# EAGLE design os20.oldenc (EAGLE 6.4)
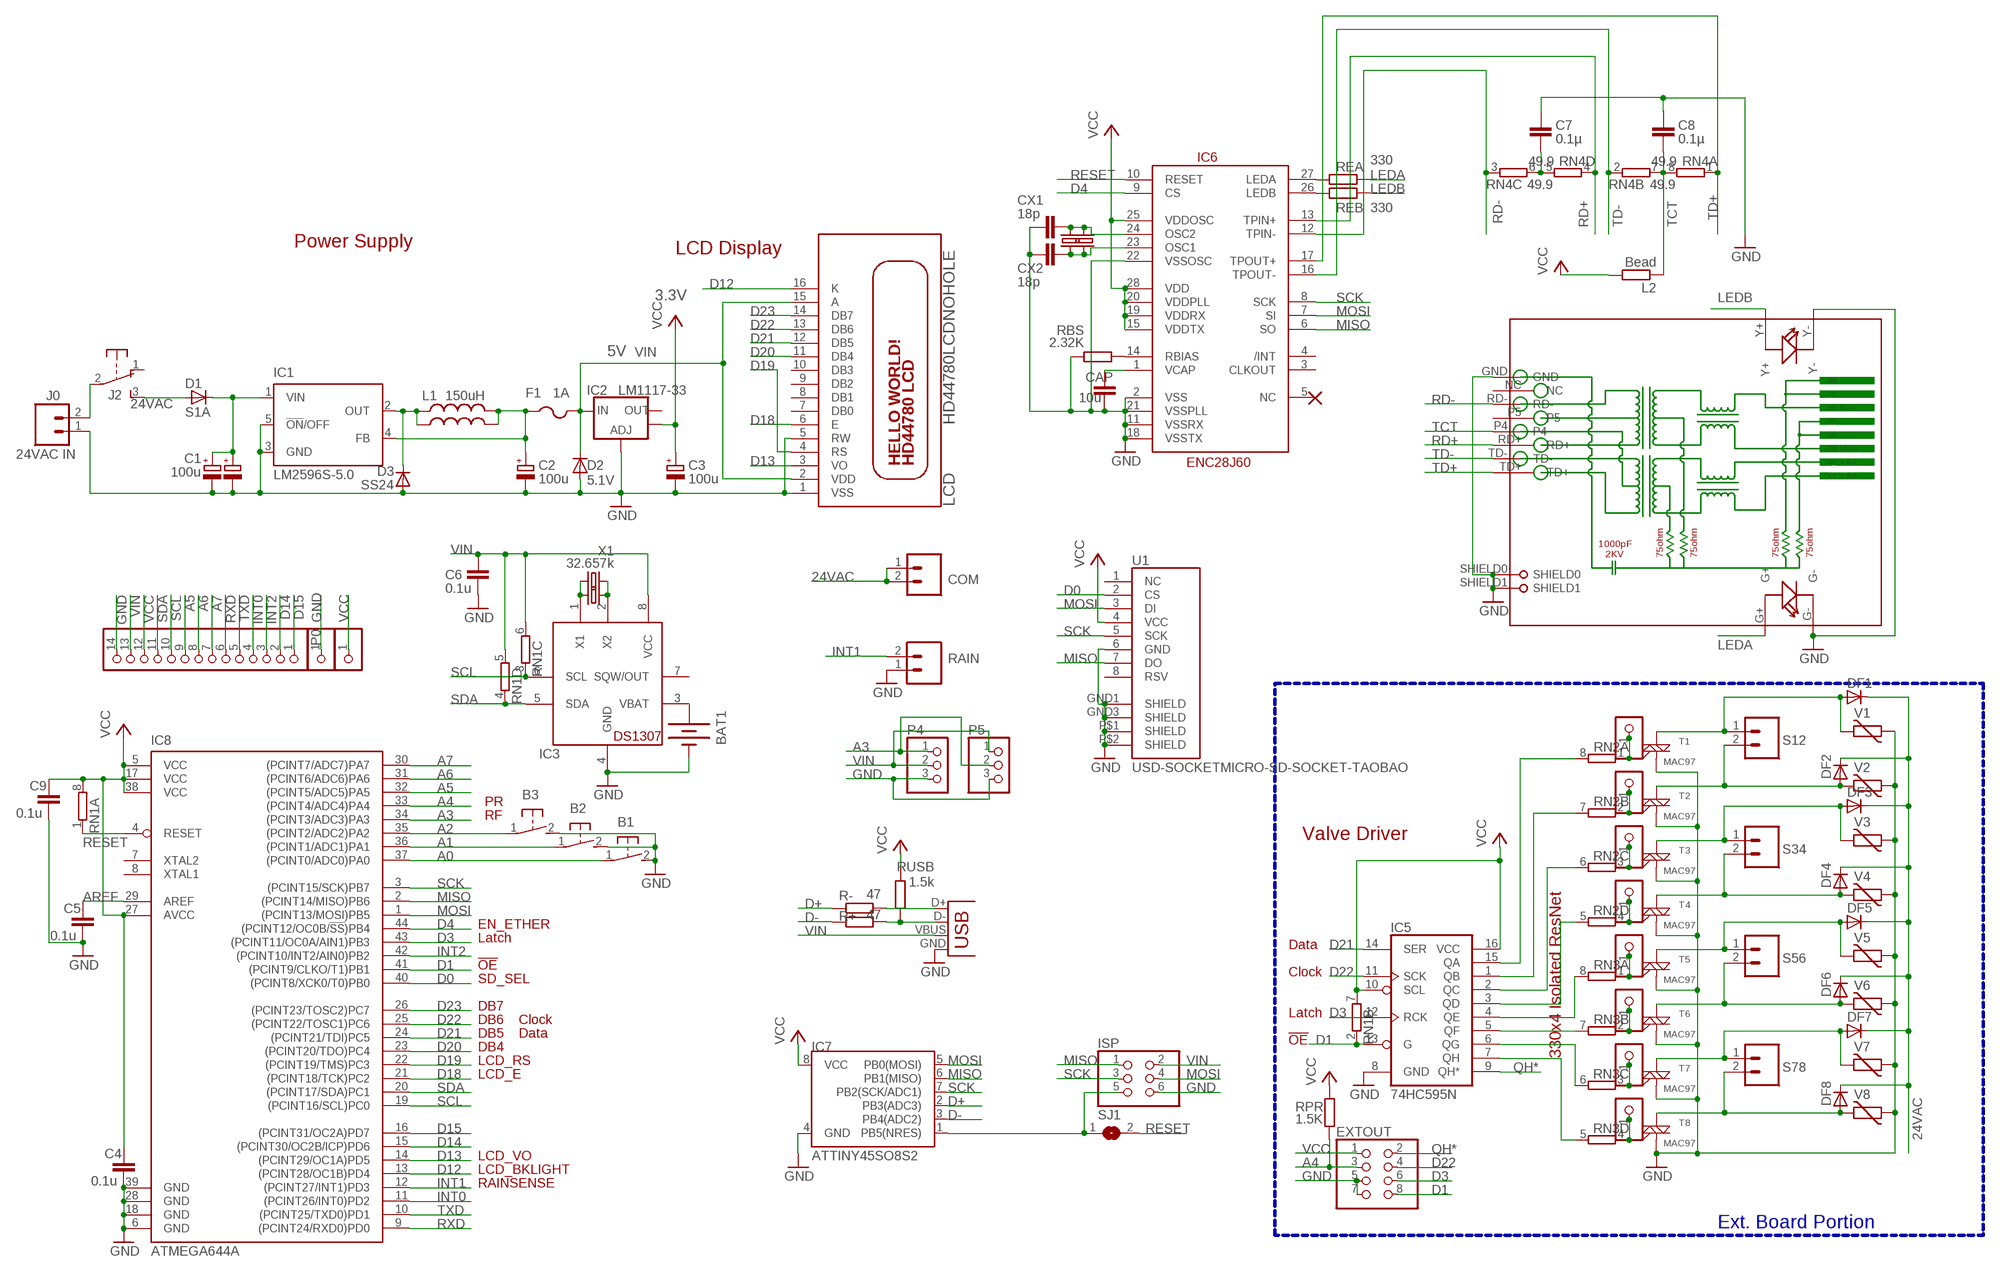
[diagram p0: schematic, sheet 1]

## Parts
B1  31-XX  [B3F-31XX]
B2  31-XX  [B3F-31XX]
B3  31-XX  [B3F-31XX]
BAT1  BATTERYBATTERY_12MM_SMT  [BATTCON_12MM_SMT]
C1  100u  CPOL-EUE3.5-8  [E3,5-8]
C1'  100u  CPOL-EUE  [PANASONIC_E]
C2  100u  CPOL-EUD  [PANASONIC_D]
C3  100u  CPOL-EUD  [PANASONIC_D]
C4  0.1u  C-EUC0805  [C0805]
C5  0.1u  C-EUC0805  [C0805]
C6  0.1u  C-EUC0805  [C0805]
C7  0.1µ  C-EUC0805  [C0805]
C8  0.1µ  C-EUC0805  [C0805]
C9  0.1u  C-EUC0805  [C0805]
CAP  10u  C-EUC0805  [C0805]
COM  M025MM  [SCREWTERMINAL-5MM-2]
CX1  18p  C-EUC0805  [C0805]
CX2  18p  C-EUC0805  [C0805]
D1  S1A  DIODE-DO-214AC  [DO-214AC]
D2  5.1V  DIODE-MINIMELF  [MINIMELF]
D3  SS24  DIODE-DO-214AC  [DO-214AC]
DF1  DIODE-D-2.5  [D-2.5]
DF2  DIODE-D-2.5  [D-2.5]
DF3  DIODE-D-2.5  [D-2.5]
DF4  DIODE-D-2.5  [D-2.5]
DF5  DIODE-D-2.5  [D-2.5]
DF6  DIODE-D-2.5  [D-2.5]
DF7  DIODE-D-2.5  [D-2.5]
DF8  DIODE-D-2.5  [D-2.5]
EXTOUT  PINHD-2X4  [2X04]
F1  1A  PTCFUSE-1812  [1812]
IC1  LM2596S-5.0  LM2596S  [TO263-5]
IC2  LM1117-33  V_REG_LM1117SOT223  [SOT223]
IC3  DS1307  DS1307SOIC  [SO08]
IC5  74HC595N  74LS595D  [SO16]
IC6  ENC28J60  ENC28J60SO28LONG  [SOIC28WLONG]
IC7  ATTINY45SO8S2  [SO8S2]
IC8  ATMEGA644A  [TQFP44]
ISP  PINHD-2X3  [2X03]
J0  24VAC IN  M025MM  [SCREWTERMINAL-5MM-2]
J2  EG1206  [EG1206]
JP2  PINHD-1X1CB  [1X01-CLEANBIG]
JP3  PINHD-1X1CB  [1X01-CLEANBIG]
JP4  PINHD-1X1CB  [1X01-CLEANBIG]
JP5  PINHD-1X1CB  [1X01-CLEANBIG]
JP6  PINHD-1X1CB  [1X01-CLEANBIG]
JP7  PINHD-1X1CB  [1X01-CLEANBIG]
JP8  PINHD-1X1CB  [1X01-CLEANBIG]
JP9  PINHD-1X1CB  [1X01-CLEANBIG]
L1  150uH  L-US6000-XXX-RC  [6000-XXXX-RC]
L1'  220uH  INDUCTORPWR  [CDRH125]
L2  Bead  R-EU_R0805  [R0805]
LCD  HD44780LCDNOHOLE  [LCD1602A]
P0  PINHD-1X14-CB  [1X14-CB]
P1  PINHD-1X1CB  [1X01-CLEANBIG]
P2  PINHD-1X1CB  [1X01-CLEANBIG]
P4  PINHD-1X3  [1X03]
P5  PINHD-1X3  [1X03]
R+  47  R-EU_R0805  [R0805]
R-  47  R-EU_R0805  [R0805]
RAIN  M025MM  [SCREWTERMINAL-5MM-2]
RBS  2.32K  R-EU_R0805  [R0805]
REA  330  R-EU_R0805  [R0805]
REB  330  R-EU_R0805  [R0805]
RJ1  HR911105A  [HR911105A]
RN1  4R-NEXB38V  [EXB38V]
RN2  4R-NEXB38V  [EXB38V]
RN3  4R-NEXB38V  [EXB38V]
RN4  49.9  4R-NEXB38V  [EXB38V]
RPR  1.5K  R-EU_R0805  [R0805]
RUSB  1.5k  R-EU_R0805  [R0805]
S12  M025MM  [SCREWTERMINAL-5MM-2]
S34  M025MM  [SCREWTERMINAL-5MM-2]
S56  M025MM  [SCREWTERMINAL-5MM-2]
S78  M025MM  [SCREWTERMINAL-5MM-2]
SJ1  SJ  [SJ]
T1  MAC97  MAC97SOT223  [SOT223]
T2  MAC97  MAC97SOT223  [SOT223]
T3  MAC97  MAC97SOT223  [SOT223]
T4  MAC97  MAC97SOT223  [SOT223]
T5  MAC97  MAC97SOT223  [SOT223]
T6  MAC97  MAC97SOT223  [SOT223]
T7  MAC97  MAC97SOT223  [SOT223]
T8  MAC97  MAC97SOT223  [SOT223]
U1  USD-SOCKETMICRO-SD-SOCKET-TAOBAO  [MICRO-SD-SOCKET-TAOBAO]
USB  USBPTH  [USB-B-PTH]
V1  MOV  VARISTOR-5  [R-5]
V2  MOV  VARISTOR-5  [R-5]
V3  MOV  VARISTOR-5  [R-5]
V4  MOV  VARISTOR-5  [R-5]
V5  MOV  VARISTOR-5  [R-5]
V6  MOV  VARISTOR-5  [R-5]
V7  MOV  VARISTOR-5  [R-5]
V8  MOV  VARISTOR-5  [R-5]
X1  32.657k  CRYSTALTC26H  [TC26H]
X1'1  32.657k  CRYSTALMM20SS  [MM20SS]
X2  25MHz  CRYSTAL10.5X4.8  [CRYSTAL-SMD-10.5X4.8-2PIN]
X2'  25MHz  CRYSTALHC49US  [HC49US]

## Nets
24VAC [power]: COM.1 COM.2 D1.A DF1.C DF2.C DF3.C DF4.C DF5.C DF6.C DF7.C DF8.C J2.3(S)
A0: B1.1(P) IC8.37((PCINT0/ADC0)PA0)
A1: B2.1(P) IC8.36((PCINT1/ADC1)PA1)
A2: B3.1(P) IC8.35((PCINT2/ADC2)PA2)
A3: IC8.34((PCINT3/ADC3)PA3) P4.1 P5.2
A4: EXTOUT.3 IC8.33((PCINT4/ADC4)PA4) RPR.1
A5: IC8.32((PCINT5/ADC5)PA5) P0.9
A6: IC8.31((PCINT6/ADC6)PA6) P0.8
A7: IC8.30((PCINT7/ADC7)PA7) P0.7
AREF: C5.1 IC8.29(AREF)
D0: IC8.40((PCINT8/XCK0/T0)PB0) U1.2(CS)
D1: EXTOUT.8 IC5.13(G) IC8.41((PCINT9/CLKO/T1)PB1) RN1.2
D3: EXTOUT.6 IC5.12(RCK) IC8.43((PCINT11/OC0A/AIN1)PB3)
D4: IC6.9(CS) IC8.44((PCINT12/OC0B/!SS!)PB4)
D12: IC8.13((PCINT28/OC1B)PD4) LCD.16(K)
D13: IC8.14((PCINT29/OC1A)PD5) LCD.3(VO)
D14: IC8.15((PCINT30/OC2B/ICP)PD6) P0.2
D15: IC8.16((PCINT31/OC2A)PD7) P0.1
D18: IC8.21((PCINT18/TCK)PC2) LCD.6(E)
D19: IC8.22((PCINT19/TMS)PC3) LCD.4(RS)
D20: IC8.23((PCINT20/TDO)PC4) LCD.11(DB4)
D21: IC5.14(SER) IC8.24((PCINT21/TDI)PC5) LCD.12(DB5)
D22: EXTOUT.4 IC5.11(SCK) IC8.25((PCINT22/TOSC1)PC6) LCD.13(DB6)
D23: IC8.26((PCINT23/TOSC2)PC7) LCD.14(DB7)
D+: IC7.2(PB3(ADC3)) R-.1
D-: IC7.3(PB4(ADC2)) R+.1
GND: B1.2(S) B2.2(S) B3.2(S) BAT1.P$1(-) C1'.- C1.- C2.- C3.- C4.2 C5.2 C6.2 C7.1 C8.1 C9.2 CAP.2 CX1.2 CX2.2 D2.A D3.A EXTOUT.5 EXTOUT.7 IC1.3(GND) IC1.5(!ON!/OFF) IC2.1(ADJ) IC3.4(GND) IC5.8(GND) IC6.2(VSS) IC6.11(VSSRX) IC6.18(VSSTX) IC6.21(VSSPLL) IC6.22(VSSOSC) IC7.4(GND) IC8.6(GND) IC8.18(GND) IC8.28(GND) IC8.39(GND) ISP.6 J0.1 LCD.1(VSS) LCD.5(RW) P0.14 P2.1 P4.3 P5.3 RAIN.1 RBS.1 RJ1.G- RJ1.GND RJ1.SHIELD0 RJ1.SHIELD1 RJ1.Y- T1.1(M1) T2.1(M1) T3.1(M1) T4.1(M1) T5.1(M1) T6.1(M1) T7.1(M1) T8.1(M1) U1.6(GND) U1.GND1(SHIELD) U1.GND3(SHIELD) U1.P$1(SHIELD) U1.P$2(SHIELD) USB.GND V1.1 V2.1 V3.1 V4.1 V5.1 V6.1 V7.1 V8.1
INT0: IC8.11((PCINT26/INT0)PD2) P0.4
INT1: IC8.12((PCINT27/INT1)PD3) RAIN.2
INT2: IC8.42((PCINT10/INT2/AIN0)PB2) P0.3
LEDA: REA.2 RJ1.G+
LEDB: REB.2 RJ1.Y+
MISO: IC6.6(SO) IC7.6(PB1(MISO)) IC8.2((PCINT14/MISO)PB6) ISP.1 U1.7(DO)
MOSI: IC6.7(SI) IC7.5(PB0(MOSI)) IC8.1((PCINT13/MOSI)PB5) ISP.4 U1.3(DI)
N$1 [power]: C1'.+ C1.+ D1.C IC1.1(VIN)
N$2 [power]: C2.+ F1.1 IC1.4(FB) L1'.2 L1.2
N$3: JP2.1 RN2.1 T1.3(G)
N$4: IC5.5(QF) RN3.7
N$5: IC5.6(QG) RN3.6
N$6 [power]: J0.2 J2.2(P)
N$7: IC5.7(QH) RN3.5
N$8: IC3.1(X1) X1'1.1 X1.2
N$9 [power]: D3.C IC1.2(OUT) L1'.1 L1.1
N$10: IC5.4(QE) RN3.8
N$11: IC5.3(QD) RN2.5
N$12: IC5.2(QC) RN2.6
N$13: IC5.1(QB) RN2.7
N$14: IC5.15(QA) RN2.8
N$15: JP3.1 RN2.2 T2.3(G)
N$16 [power]: DF1.A S12.1 T1.4(M2) V1.2
N$17 [power]: DF2.A S12.2 T2.4(M2) V2.2
N$18 [power]: DF3.A S34.1 T3.4(M2) V3.2
N$19: JP4.1 RN2.3 T3.3(G)
N$20 [power]: DF4.A S34.2 T4.4(M2) V4.2
N$21: JP5.1 RN2.4 T4.3(G)
N$22 [power]: DF5.A S56.1 T5.4(M2) V5.2
N$23 [power]: DF6.A S56.2 T6.4(M2) V6.2
N$24 [power]: DF7.A S78.1 T7.4(M2) V7.2
N$25 [power]: DF8.A S78.2 T8.4(M2) V8.2
N$26: JP6.1 RN3.1 T5.3(G)
N$27: JP7.1 RN3.2 T6.3(G)
N$28: JP8.1 RN3.3 T7.3(G)
N$29: JP9.1 RN3.4 T8.3(G)
N$30: IC3.2(X2) X1'1.4 X1.1
N$34: IC6.27(LEDA) REA.1
N$36: BAT1.P$2(+) IC3.3(VBAT)
N$37: IC6.26(LEDB) REB.1
N$38: R-.2 USB.D+
N$39: CAP.1 IC6.1(VCAP)
N$41: CX1.1 IC6.24(OSC2) X2'.2 X2.P$2
N$42: CX2.1 IC6.23(OSC1) X2'.1 X2.P$1
N$45: R+.2 RUSB.1 USB.D-
N$52: IC7.1(PB5(NRES)) ISP.5 SJ1.1
N$54: C7.2 RN4.5 RN4.6
N$59: IC6.14(RBIAS) RBS.2
QH*: EXTOUT.2 IC5.9(QH*)
RD+: IC6.13(TPIN+) RJ1.RD+ RN4.4
RD-: IC6.12(TPIN-) RJ1.RD- RN4.3
RESET: IC6.10(RESET) IC8.4(RESET) RN1.1 SJ1.2
RXD: IC8.9((PCINT24/RXD0)PD0) P0.6
SCK: IC6.8(SCK) IC7.7(PB2(SCK/ADC1)) IC8.3((PCINT15/SCK)PB7) ISP.3 U1.5(SCK)
SCL: IC3.6(SCL) IC8.19((PCINT16/SCL)PC0) P0.10 RN1.3
SDA: IC3.5(SDA) IC8.20((PCINT17/SDA)PC1) P0.11 RN1.4
TCT: C8.2 L2.1 RJ1.P4 RN4.7 RN4.8
TD+: IC6.17(TPOUT+) RJ1.TD+ RN4.1
TD-: IC6.16(TPOUT-) RJ1.TD- RN4.2
TXD: IC8.10((PCINT25/TXD0)PD1) P0.5
VCC: C3.+ C4.1 C9.1 EXTOUT.1 IC2.4(OUT) IC5.10(SCL) IC5.16(VCC) IC6.15(VDDTX) IC6.19(VDDRX) IC6.20(VDDPLL) IC6.25(VDDOSC) IC6.28(VDD) IC7.8(VCC) IC8.5(VCC) IC8.17(VCC) IC8.27(AVCC) IC8.38(VCC) L2.2 P0.12 P1.1 RN1.7 RN1.8 RPR.2 RUSB.2 U1.4(VCC)
VIN [power]: C6.1 D2.C F1.2 IC2.3(IN) IC3.8(VCC) ISP.2 LCD.2(VDD) LCD.15(A) P0.13 P4.2 P5.1 RN1.5 RN1.6 USB.VBUS
Unconnected: IC2.2(OUT) IC3.7(SQW/OUT) IC6.3(CLKOUT) IC6.4(/INT) IC6.5(NC) IC8.7(XTAL2) IC8.8(XTAL1) J2.1(O) LCD.7(DB0) LCD.8(DB1) LCD.9(DB2) LCD.10(DB3) RJ1.NC RJ1.P5 U1.1(NC) U1.8(RSV)

## Buses
B$1

## Notes on the sheet
- Power Supply
- LCD Display
- 3.3V
- 5V
- PR
- RF
- Valve Driver
- EN_ETHER
- Latch
- Data
- !OE
- Clock
- SD_SEL
- DB7
- Latch
- DB6 | Clock
- DB5 | Data
- !OE
- DB4
- 330x4 Isolated ResNet
- LCD_RS
- LCD_E
- LCD_VO
- LCD_BKLIGHT
- RAINSENSE
- Ext. Board Portion

## Library data of the parts
B1-B3 = adafruit:31-XX: OMRON SWITCH Now with beefier pads!
BAT1 = SparkFunNew:BATTERY: Battery Holders Various common sizes : AA, AAA, 20mm coin cell and 12mm coin cell.
C1 C1' C2 C3 = resistor:CPOL-EU: POLARIZED CAPACITOR, European symbol
C4-C6 C9 = rcl:C-EU: CAPACITOR, European symbol
C7 C8 CAP CX1 CX2 = resistor:C-EU: CAPACITOR, European symbol
COM J0 RAIN S12 S34 S56 S78 = SparkFun:M02: Header 2 Standard 2-pin 0.1" header. Use with straight break away headers (SKU : PRT-00116), right angle break away headers (PRT-00553), swiss pins (PRT-00743), machine pins (PRT-00117), and female headers (PRT-00115). Molex polarized connector foot print use with SKU : PRT-08233 with associated crimp pins and housings.
D1-D3 DF1-DF8 = diode:DIODE-: DIODE
EXTOUT = pinhead:PINHD-2X4: PIN HEADER
F1 = adafruit:PTCFUSE: PTC fuses, resettable thermistors
IC1 = national-semiconductor:LM2596: SIMPLE SWITCHER® Power Converter 150 kHz 3A Step-Down Voltage Regulator Source: http://www.national.com/ds/LM/LM2596.pdf; MF: NATIONAL SEMICONDUCTOR; MPN: LM2596S-ADJ/NOPB; OC_FARNELL: 9494367; OC_NEWARK: 41K3842
IC2 = SparkFun:V_REG_LM1117: Voltage Regulator LM1117 Standard adjustable voltage regulator but in SMD form. Spark Fun Electronics SKU : COM-00595
IC3 = adafruit:DS1307: DS1307 Real time clock (RTC) with battery backup ability. Talk to it via i2c
IC5 = SparkFun:74*595: 8-bit SHIFT REGISTER, output latch
IC6 = SparkFun:ENC28J60
IC7 = SparkFun:ATTINY45: Atmel ATTiny45
IC8 = atmel:ATMEGA644: 8-bit Microcontroller with 64K Bytes In-System Programmable Flash Source: http://www.atmel.com/dyn/resources/prod_documents/doc2593.pdf; MPN: ATMEGA644PV-10AU; OC_FARNELL: 1455123; OC_NEWARK: 58M3748
ISP = pinhead:PINHD-2X3: PIN HEADER
J2 = adafruit:EG1206
JP2-JP9 P1 P2 = adafruit:PINHD-1X1: Pin header 1x1 for 0.1" spacing With round pins
L1 = rcl:L-US: INDUCTOR, American symbol
L1' = SparkFunNew:INDUCTOR: Inductors Basic Inductor/Choke - 0603 and 1206. Footprints are not proven and vary greatly between part numbers.
L2 R+ R- RBS REA REB RPR RUSB = rcl:R-EU_: RESISTOR, European symbol
LCD = adafruit:HD44780LCD: HD44780 LCD Standard character type LCDs, available in sizes from 8x1 to 40x4!
P0 = adafruit:PINHD-1X14: PIN HEADER
P4 P5 = pinhead:PINHD-1X3: PIN HEADER
RJ1 = CONNECTER:HR911105A
RN1-RN4 = resistor-dil:4R-N: Array Chip Resistor Source: RS Component / Phycomp; OC_FARNELL: unknown; OC_NEWARK: unknown
SJ1 = jumper:SJ: SMD solder JUMPER
T1-T8 = SparkFun:MAC97: MAC97 Triac http://www.onsemi.com/pub_link/Collateral/MAC97-D.PDF
U1 = SparkFunNew:USD-SOCKET: microSD Socket Push-push type uSD socket. Schematic element and footprint production proven. Spark Fun Electronics SKU : PRT-00127. tDoc lines correctly indicate media card edge positions when inserting (unlocked, locked, depressed).
USB = SparkFunNew:USB: USB Connectors USB-B-PTH is fully proven SKU : PRT-00139 USB-miniB is fully proven SKU : PRT-00587 USB-A-PCB is untested. USB-A-H is throughly reviewed, but untested. Spark Fun Electronics SKU : PRT-00437 USB-B-SMT is throughly reviewed, but untested. Needs silkscreen touching up. USB-A-S has not been used/tested USB-MB-H has not been used/tested
V1-V8 = varistor:VARISTOR: VARISTOR
X1 X1'1 = crystal:CRYSTAL: CRYSTAL; OC_FARNELL: unknown; OC_NEWARK: unknown
X2 X2' = SparkFun:CRYSTAL: Crystals Various standard crystals. Proven footprints. Spark Fun Electronics SKU : COM-00534

## Net classes
0 default: width 0.305 mm, clearance 0.203 mm
1 power: width 0.61 mm, clearance 0.203 mm

## Board
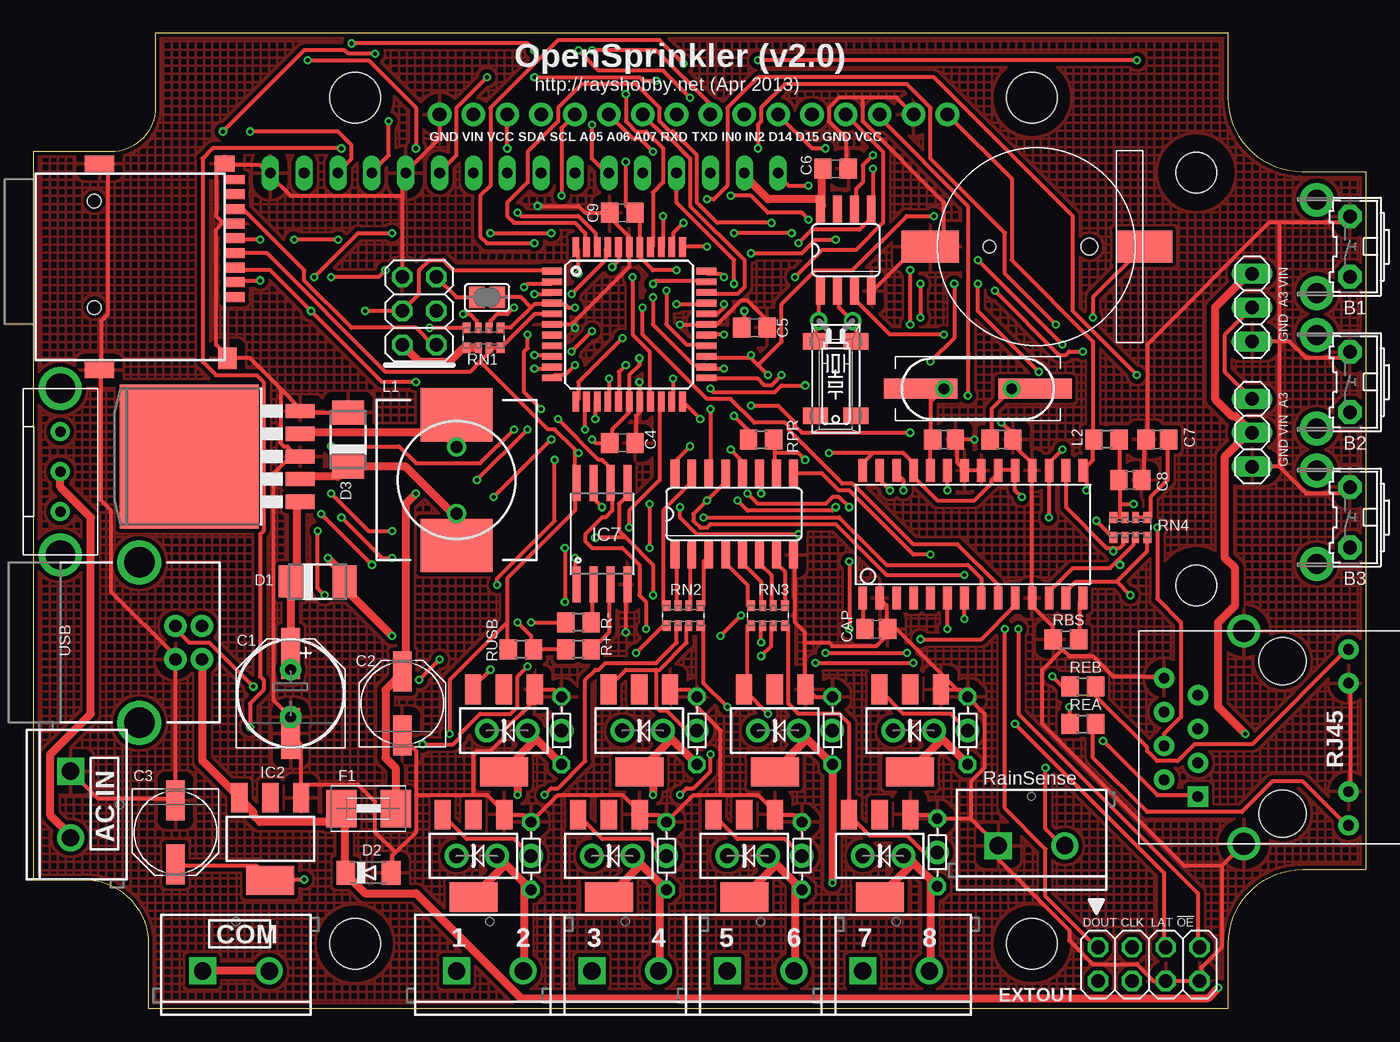
[diagram p1: board, top side]
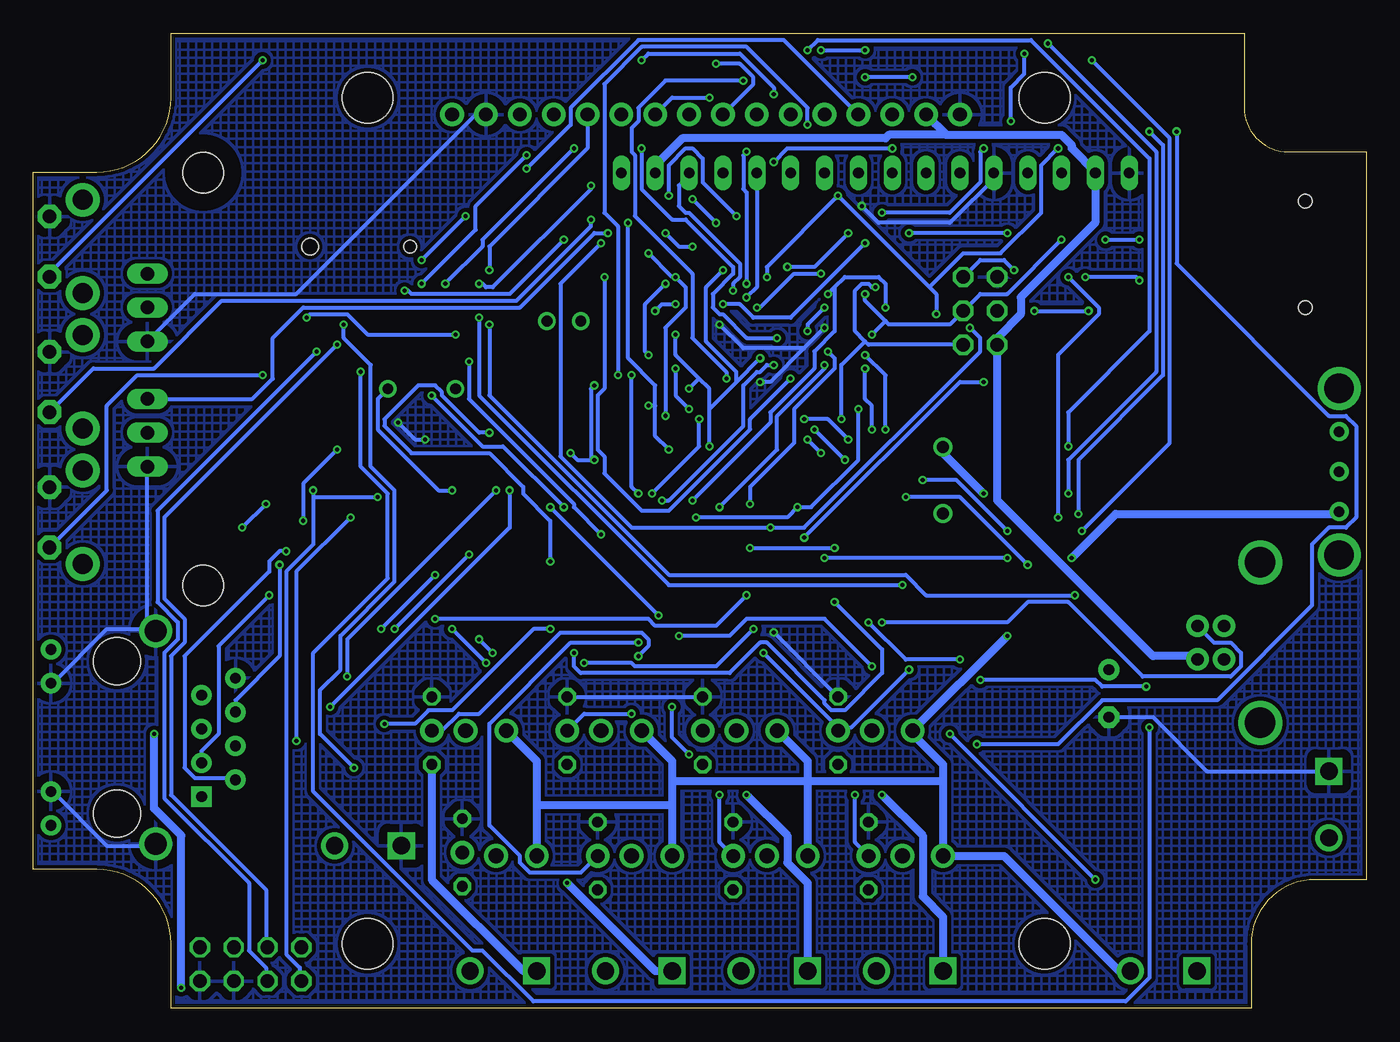
[diagram p2: board, bottom side, seen from below]

Size 100 x 73.15 mm. Coordinates in mm from the lower left corner, seen from the top.
Outline: 8.64,0 89.66,0 89.66,4.83 arc-90 95.25,10.41 100,10.41 100,62.74 95.25,62.74 arc-90 89.66,68.33 89.66,73.15 9.14,73.15 9.14,67.56 arc-90 5.84,64.26 0,64.26 0,9.65 3.81,9.65 arc-90 8.64,4.83 8.64,0
Copper layers (1*16): Top 0.035mm / dielectric 1.5mm / Bottom 0.035mm
Design rules "default": minimum track width 6mil, minimum drill 12mil, track to track 6mil, track to pad 6mil, pad to pad 8mil, via to via 8mil, smd to smd 0mil, copper to edge 10mil, drill to drill 10mil, minimum pad ring 10mil, minimum via ring 6mil, stop-mask expansion 2mil, vias tented up to drill 100mil, thermal gap 25mil
Holes 3.81 mm at 24.13,4.83 74.93,4.83 24.13,68.33 74.93,68.33
Holes 3.05 mm at 87.25,62.69 87.25,31.72
tRestrict: area 21.6,2.3 to 26.7,7.4; area 72.4,2.3 to 77.5,7.4; area 84.7,29.2 to 89.8,34.3; area 84.7,60.1 to 89.8,65.2; area 21.6,65.8 to 26.7,70.9; area 72.4,65.8 to 77.5,70.9
bRestrict: area 84.7,60.1 to 89.8,65.2; area 84.7,29.2 to 89.8,34.3
vRestrict: area 78.7,6.1 to 88.1,6.6; area 72.1,0.5 to 77.7,1.5; area 29.7,65 to 69.6,65.8

### Footprints (pad centres in the part's own frame; a part is rotated, then mirrored left to right if it is on the bottom)
B3F-31XX = drill 1.016 pad 1.778 octagon: 1 -2.261,-1.245; 2 2.261,-1.245 | drill 1.499 pad 2.54: 3 -3.505,1.245; 4 3.505,1.245
BATTCON_12MM_SMT = smd 2.4 x 4.3: P$1 0,11.96 | smd 2.4 x 4.2: P$2 0,-4.1 | hole 0.95: 0,7.5 | hole 1.25: 0,0
E3,5-8 = drill 0.813 pad 1.6: + -1.778,0 | drill 0.813 pad 1.6 octagon: - 1.778,0
PANASONIC_E = smd 3.8 x 1.4: + 3,0; - -3,0
PANASONIC_D = smd 3 x 1.4: + 2.4,0; - -2.4,0
C0805 = smd 1.3 x 1.5: 1 -0.95,0; 2 0.95,0
C0805' = smd 1.3 x 1.5: 1 -0.85,0; 2 0.85,0
SCREWTERMINAL-5MM-2 = drill 1.3 pad 2.032 square: 1 0,0 | drill 1.3 pad 2.032: 2 5,0
DO-214AC = smd 1.8 x 2.4: A 2.025,0; C -2.025,0
MINIMELF = smd 1.4 x 1.8: A 1.7,0; C -1.7,0
D-2.5 = drill 1.1 pad 1.778: A 1.778,0; C -1.27,0
2X04 = drill 1.016 octagon: 1 -3.81,-1.27; 2 -3.81,1.27; 3 -1.27,-1.27; 4 -1.27,1.27; 5 1.27,-1.27; 6 1.27,1.27; 7 3.81,-1.27; 8 3.81,1.27
1812 = smd 2.286 x 2.794: 1 -2.046,0; 2 2.046,0
TO263-5 = smd 1.067 x 2.159: 1 -3.404,-5.791; 2 -1.702,-5.791; 3 0,-5.791; 4 1.702,-5.791; 5 3.404,-5.791 | smd 10.8 x 10.41: 6 0,2.54
SOT223 = smd 1.219 x 2.235: 1 -2.311,-3.099; 2 0,-3.099; 3 2.311,-3.099 | smd 3.6 x 2.2: 4 0,3.099
SO08 = smd 0.66 x 2.032: 1 -1.905,-3.073; 2 -0.635,-3.073; 3 0.635,-3.073; 4 1.905,-3.073; 5 1.905,3.073; 6 0.635,3.073; 7 -0.635,3.073; 8 -1.905,3.073
SO16 = smd 0.66 x 2.032: 1 -4.445,-3.073; 2 -3.175,-3.073; 3 -1.905,-3.073; 4 -0.635,-3.073; 5 0.635,-3.073; 6 1.905,-3.073; 7 3.175,-3.073; 8 4.445,-3.073; 9 4.445,3.073; 10 3.175,3.073; 11 1.905,3.073; 12 0.635,3.073; 13 -0.635,3.073; 14 -1.905,3.073; 15 -3.175,3.073; 16 -4.445,3.073
SOIC28WLONG = smd 0.65 x 1.7: 1 -8.89,-4.78; 2 -7.62,-4.78; 3 -6.35,-4.78; 4 -5.08,-4.78; 5 -3.81,-4.78; 6 -2.54,-4.78; 7 -1.27,-4.78; 8 0,-4.78; 9 1.27,-4.78; 10 2.54,-4.78; 11 3.81,-4.78; 12 5.08,-4.78; 13 6.35,-4.78; 14 7.62,-4.78; 15 7.62,4.78; 16 6.35,4.78; 17 5.08,4.78; 18 3.81,4.78; 19 2.54,4.78; 20 1.27,4.78; 21 0,4.78; 22 -1.27,4.78; 23 -2.54,4.78; 24 -3.81,4.78; 25 -5.08,4.78; 26 -6.35,4.78; 27 -7.62,4.78; 28 -8.89,4.78
SO8S2 = smd 0.61 x 2.7: 1 -1.905,-3.778; 2 -0.635,-3.778; 3 0.635,-3.778; 4 1.905,-3.778; 5 1.905,3.853; 6 0.635,3.853; 7 -0.635,3.853; 8 -1.905,3.853
TQFP44 = smd 1.5 x 0.5: 1 -5.8,4; 2 -5.8,3.2; 3 -5.8,2.4; 4 -5.8,1.6; 5 -5.8,0.8; 6 -5.8,0; 7 -5.8,-0.8; 8 -5.8,-1.6; 9 -5.8,-2.4; 10 -5.8,-3.2; 11 -5.8,-4; 23 5.8,-4; 24 5.8,-3.2; 25 5.8,-2.4; 26 5.8,-1.6; 27 5.8,-0.8; 28 5.8,0; 29 5.8,0.8; 30 5.8,1.6; 31 5.8,2.4; 32 5.8,3.2; 33 5.8,4 | smd 0.5 x 1.5: 12 -4,-5.8; 13 -3.2,-5.8; 14 -2.4,-5.8; 15 -1.6,-5.8; 16 -0.8,-5.8; 17 0,-5.8; 18 0.8,-5.8; 19 1.6,-5.8; 20 2.4,-5.8; 21 3.2,-5.8; 22 4,-5.8; 34 4,5.8; 35 3.2,5.8; 36 2.4,5.8; 37 1.6,5.8; 38 0.8,5.8; 39 0,5.8; 40 -0.8,5.8; 41 -1.6,5.8; 42 -2.4,5.8; 43 -3.2,5.8; 44 -4,5.8
2X03 = drill 1.016 octagon: 1 -2.54,-1.27; 2 -2.54,1.27; 3 0,-1.27; 4 0,1.27; 5 2.54,-1.27; 6 2.54,1.27
EG1206 = drill 0.8 pad 1.422: 1 -3,0; 2 0,0; 3 3,0 | drill 2.2: MT1 -6.25,0; MT2 6.25,0
1X01-CLEANBIG = drill 1.016 pad 1.778: 1 0,0
6000-XXXX-RC = drill 0.9 pad 1.422: 1 -2.5,0; 2 2.5,0
CDRH125 = smd 5.4 x 4: 1 0,4.9; 2 0,-4.9
R0805 = smd 1.3 x 1.5: 1 -0.95,0; 2 0.95,0
LCD1602A = drill 0.8 long: 1 8,33.46; 2 10.54,33.46; 3 13.08,33.46; 4 15.62,33.46; 5 18.16,33.46; 6 20.7,33.46; 7 23.24,33.46; 8 25.78,33.46; 9 28.32,33.46; 10 30.86,33.46; 11 33.4,33.46; 12 35.94,33.46; 13 38.48,33.46; 14 41.02,33.46; 15 43.56,33.46; 16 46.1,33.46
1X14-CB = drill 1.016 pad 1.778: 1 -16.51,0; 2 -13.97,0; 3 -11.43,0; 4 -8.89,0; 5 -6.35,0; 6 -3.81,0; 7 -1.27,0; 8 1.27,0; 9 3.81,0; 10 6.35,0; 11 8.89,0; 12 11.43,0; 13 13.97,0; 14 16.51,0
1X03 = drill 1.016 long: 1 -2.54,0; 2 0,0; 3 2.54,0
HR911105A = drill 0.813 pad 1.524: G+ 4.953,-6.604; G- 4.953,-4.064; GND -8.89,4.445; NC -6.35,3.175; P4 -8.89,-0.635; P5 -6.35,0.635; RD+ -6.35,-1.905; RD- -8.89,1.905; TD- -8.89,-3.175; Y+ 4.953,6.604; Y- 4.953,4.064 | drill 1.651 pad 2.159: SHIELD0 -2.921,8.001; SHIELD1 -2.921,-8.001 | drill 0.813 pad 1.524 square: TD+ -6.35,-4.445 | hole 3.556: 0,-5.715; 0,5.715
EXB38V = smd 0.6 x 0.8: 1 -1.275,-0.75; 4 1.275,-0.75; 5 1.275,0.75; 8 -1.275,0.75 | smd 0.5 x 0.8: 2 -0.4,-0.75; 3 0.4,-0.75; 6 0.4,0.75; 7 -0.4,0.75
SJ = smd 1.168 x 1.6: 1 -0.762,0; 2 0.762,0
MICRO-SD-SOCKET-TAOBAO = smd 0.75 x 1.6: 1 2.25,10.5; 2 1.15,10.5; 3 0.05,10.5; 4 -1.05,10.5; 5 -2.15,10.5; 6 -3.25,10.5; 7 -4.35,10.5; 8 -5.45,10.5 | smd 0.7 x 1.6: CD -6.55,10.5 | smd 1.2 x 1.5: GND1 -7.75,9.8 | smd 1.6 x 1.4: GND3 6.85,10 | smd 1.2 x 2.2: P$1 7.75,0.4; P$2 -7.75,0.4 | hole 1: 3.05,0; -4.93,0
USB-B-PTH = drill 0.914 pad 1.676: D+ 0,1.25; D- 1.981,1.25; GND 0,-1.25; VBUS 1.981,-1.25 | drill 2.286: S1 -2.718,-6.02; S2 -2.718,6.02
R-5 = drill 0.813 octagon: 1 -2.54,0; 2 2.54,0
TC26H = drill 0.813: 1 -1.27,0; 2 1.27,0
MM20SS = smd 1.27 x 1.88: 1 -2.794,-1.524; 2 2.794,-1.524; 3 2.794,1.524; 4 -2.794,1.524
CRYSTAL-SMD-10.5X4.8-2PIN = smd 5.5 x 1.5: P$1 -4.3,0; P$2 4.3,0
HC49US = drill 0.813: 1 -2.54,0; 2 2.54,0

### Placement (x,y rotation side)
B1  97.54,57.15 90 top
B2  97.54,46.99 90 top
B3  97.54,36.83 90 top
BAT1  79.25,57.15 90 top
C1  19.3,23.62 270 top
C1'  19.3,23.62 90 top
C2  27.69,22.86 90 top
C3  10.67,13.21 270 top
C4  44.2,42.42 0 top
C5  54.1,51.05 0 top
C6  60.2,62.99 0 top
C7  0.1µ  [C0805']  84.33,42.67 0 top
C8  0.1µ  [C0805']  82.3,39.62 180 top
C9  44.2,59.69 180 top
CAP  10u  [C0805']  63.25,28.45 0 top
COM  12.7,2.79 0 top
CX1  18p  [C0805']  68.33,42.67 0 top
CX2  18p  [C0805']  72.64,42.67 0 top
D1  21.34,32 0 top
D2  25.15,10.16 0 top
D3  23.62,42.67 90 top
DF1  35.31,20.83 0 top
DF2  33.02,11.43 0 top
DF3  45.47,20.83 0 top
DF4  43.18,11.43 0 top
DF5  55.63,20.83 0 top
DF6  53.34,11.43 0 top
DF7  65.79,20.83 0 top
DF8  63.5,11.43 0 top
EXTOUT  83.69,3.3 0 top
F1  25.15,14.99 180 top
IC1  14.22,41.4 90 top
IC2  17.78,12.7 180 top
IC3  60.96,56.9 0 top
IC5  52.58,37.08 0 top
IC6  71.12,35.56 0 top
IC7  42.67,35.56 0 top
IC8  44.7,51.31 0 top
ISP  28.96,52.32 90 top
J0  2.79,17.78 270 top
J2  2.03,40.26 270 top
JP2  39.62,20.83 0 top
JP3  37.34,11.43 0 top
JP4  49.78,20.83 0 top
JP5  47.5,11.43 0 top
JP6  59.94,20.83 0 top
JP7  57.66,11.43 0 top
JP8  70.1,20.83 0 top
JP9  67.82,11.68 0 top
L1  31.75,39.62 90 top
L1'  31.75,39.62 180 top
L2  80.52,42.67 180 top
LCD  9.78,29.21 0 top
P0  46.99,67.06 180 top
P1  68.58,67.06 0 top
P2  66.04,67.06 0 top
P4  91.44,43.18 270 top
P5  91.44,52.58 270 top
R+  40.89,26.92 180 top
R-  40.89,28.96 180 top
RAIN  72.39,12.19 0 top
RBS  77.47,27.69 0 top
REA  78.74,21.34 0 top
REB  78.74,24.13 0 top
RJ1  93.73,20.32 0 top
RN1  33.78,50.29 180 top
RN2  48.77,29.46 0 top
RN3  55.12,29.46 0 top
RN4  82.3,36.07 0 top
RPR  54.61,42.67 0 top
RUSB  36.58,26.92 180 top
S12  31.75,2.79 0 top
S34  41.91,2.79 0 top
S56  52.07,2.79 0 top
S78  62.23,2.79 0 top
SJ1  34.04,53.34 0 top
T1  35.31,20.83 180 top
T2  33.02,11.43 180 top
T3  45.47,20.83 180 top
T4  43.18,11.43 180 top
T5  55.63,20.83 180 top
T6  53.34,11.43 180 top
T7  65.79,20.83 180 top
T8  63.5,11.43 180 top
U1  4.57,55.63 270 top
USB  10.67,27.43 0 top
V1  39.62,20.83 270 top
V2  37.34,11.43 270 top
V3  49.78,20.83 270 top
V4  47.5,11.43 270 top
V5  59.94,20.83 270 top
V6  57.66,11.43 270 top
V7  70.1,20.83 270 top
V8  67.82,11.68 270 top
X1  60.2,51.56 180 top
X1'1  60.2,47.24 270 top
X2  70.87,46.48 180 top
X2'  70.87,46.48 180 top

### Tracks (layer width: path | path; a pad name or v marks a point on that pad's centre or on a via)
24VAC  (via drill 0.3)
  Top 0.61: COM.2 COM.1 | v26.92,27.94 23.37,31.5 D1.A 23.37,32.26 23.37,32.51 v22.1,33.78
  Bottom 0.61: 52.07,17.02 52.07,18.54 DF5.C | 52.07,17.02 52.07,15.24 | 52.07,15.24 DF6.C | 62.23,15.24 62.23,18.54 DF7.C | 62.23,15.24 DF8.C | 62.23,15.24 52.07,15.24 | 41.91,17.02 41.91,18.54 DF3.C | 41.91,17.02 DF4.C | v26.92,27.94 DF1.C 34.04,20.57 31.75,18.29 31.75,17.02 | v22.1,33.78 18.8,37.08 2.03,37.08 J2.3 | 31.75,17.02 DF2.C 27.18,11.43 18.54,2.79 COM.2 | 31.75,17.02 41.91,17.02 | 41.91,17.02 52.07,17.02
A0  (via drill 0.3)
  Top 0.305: v44.45,68.58 44.45,66.55 45.21,65.79 45.97,65.79 47.24,64.52 47.24,61.98 46.48,61.21 46.48,57.15 IC8.37 | v82.8,71.12 v54.36,71.12
  Bottom 0.305: v44.45,68.58 44.45,69.09 46.99,71.63 53.85,71.63 v54.36,71.12 | v82.8,71.12 98.81,55.12 B1.1
A1  (via drill 0.3)
  Top 0.305: v47.24,59.44 47.24,57.15 IC8.36 | v52.32,60.96 53.85,60.96 55.12,59.69 57.66,59.69 v58.17,59.18
  Bottom 0.305: v47.24,59.44 49.78,61.98 49.78,63.75 50.55,64.52 51.05,64.52 52.32,63.25 v52.32,60.96 | v58.17,59.18 58.17,58.67 63.75,53.09 85.85,53.09 90.93,48.01 95.5,48.01 B2.1
A2  (via drill 0.3)
  Top 0.305: v48.77,58.93 48.01,58.17 48.01,57.15 IC8.35 | v50.55,60.71 51.05,60.71 52.07,61.72 52.07,67.56 54.36,69.85 67.56,69.85 77.98,59.44 77.98,52.32 v82.8,47.5
  Bottom 0.305: v50.55,60.71 v48.77,58.93 | v82.8,47.5 92.2,47.5 94.49,45.21 94.49,38.86 B3.1
A3  (via drill 0.3)
  Top 0.305: v50.55,57.15 48.77,57.15 IC8.34 | v56.9,58.17 v52.58,58.17 | P5.2 89.41,50.55 89.41,47.75 P4.1
  Bottom 0.305: v50.55,57.15 51.56,57.15 v52.58,58.17 | v56.9,58.17 57.91,58.17 63.5,52.58 79.76,52.58 82.04,50.29 82.04,47.24 83.57,45.72 P4.1
A4  (via drill 0.3)
  Top 0.305: v52.58,44.45 53.59,43.43 53.59,42.67 RPR.1 | v51.82,54.86 51.56,55.12 50.55,55.12 IC8.33 | v78.74,49.28 77.72,49.28 77.47,49.02 76.96,49.02 v72.14,53.85 | v60.2,57.66 58.67,57.66 57.66,56.64 v53.85,56.64
  Bottom 0.305: v52.58,44.45 52.58,51.05 51.05,52.58 51.05,54.1 v51.82,54.86 52.07,54.86 v53.85,56.64 | v78.74,49.28 90.68,37.34 90.68,30.48 89.15,28.96 89.15,27.69 90.17,26.67 90.17,15.75 83.82,9.4 83.82,4.32 82.55,3.05 82.55,2.03 EXTOUT.3 | v72.14,53.85 71.88,53.85 71.63,53.59 64.26,53.59 v60.2,57.66
A5  (via drill 0.3)
  Top 0.305: v46.48,54.36 46.74,54.61 50.29,54.61 IC8.32 | v46.48,64.26 45.47,65.28 44.96,65.28 P0.9
  Bottom 0.305: v46.48,54.36 46.48,61.21 46.74,61.47 46.74,64.01 v46.48,64.26
A6
  Top 0.305: P0.8 47.5,65.28 47.75,65.28 49.28,63.75 49.28,60.2 53.34,56.13 53.34,54.1 52.83,53.59 50.55,53.59 IC8.31
A7  (via drill 0.3)
  Top 0.305: v48.26,52.83 50.29,52.83 IC8.30 | v37.59,57.4 34.04,57.4 33.53,57.91 33.53,60.96 34.29,61.72 34.29,67.56 39.37,72.64 46.99,72.64 v48.77,70.87
  Bottom 0.305: v48.26,52.83 46.99,52.83 45.97,51.82 43.18,51.82 v37.59,57.4 | v48.77,70.87 46.99,70.87 45.97,69.85 45.97,69.34 P0.7
AREF  (via drill 0.3)
  Top 0.305: v51.82,52.83 51.82,52.58 51.31,52.07 50.55,52.07 IC8.29 | v53.34,52.32 53.34,51.05 C5.1
  Bottom 0.305: v51.82,52.83 52.83,52.83 v53.34,52.32
D0  (via drill 0.3)
  Top 0.305: v43.43,55.63 43.94,56.13 43.94,56.9 IC8.40 | v34.29,58.17 v38.86,58.17 | v26.92,58.17 24.38,58.17 v21.08,54.86 | v17.02,54.61 15.24,54.61 U1.2
  Bottom 0.305: v43.43,55.63 41.4,55.63 v38.86,58.17 | v26.92,58.17 v34.29,58.17 | v21.08,54.86 17.27,54.86 v17.02,54.61
D1  (via drill 0.3)
  Top 0.305: v36.07,52.58 35.56,52.07 34.8,52.07 34.29,51.56 34.29,51.05 RN1.2 | v40.39,53.59 42.93,56.13 42.93,56.9 IC8.41 | IC5.13 51.82,40.13 51.82,39.37 v50.55,38.1 49.53,37.08 49.53,36.58 50.04,36.07 50.55,36.07 50.8,36.32 60.2,36.32 64.01,32.51 v69.85,32.51 | v73.91,28.45 73.91,22.1 87.38,8.64 87.38,4.57 EXTOUT.8
  Bottom 0.305: v36.07,52.58 36.07,54.36 36.58,54.86 39.12,54.86 39.88,54.1 | v40.39,53.59 39.88,54.1 | v50.55,38.1 44.7,43.94 44.7,44.7 41.4,48.01 41.4,49.28 39.88,50.8 39.88,54.1 | v69.85,32.51 v73.91,28.45
D3  (via drill 0.3)
  Top 0.305: v55.37,58.93 51.31,58.93 49.78,60.45 49.78,64.01 48.01,65.79 47.75,65.79 46.99,66.55 46.99,67.56 45.21,69.34 41.15,69.34 39.37,67.56 39.37,66.55 37.08,64.26 37.08,61.98 35.56,60.45 35.56,59.44 36.07,58.93 40.64,58.93 41.4,58.17 41.4,57.15 IC8.43 | v52.32,41.91 53.09,41.15 53.09,40.39 IC5.12 | v73.66,21.34 84.84,10.16 84.84,4.57 EXTOUT.6 | v61.21,33.53 v61.21,28.45 | v65.79,43.18 57.66,43.18 57.15,43.69 57.15,43.94 55.88,45.21 v53.85,45.21
  Bottom 0.305: v55.37,58.93 55.37,48.77 53.34,46.74 53.34,45.21 | 53.34,45.21 53.34,42.93 v52.32,41.91 | v73.66,21.34 71.37,21.34 70.36,22.35 68.58,22.35 62.48,28.45 v61.21,28.45 | v61.21,33.53 61.21,36.58 63.25,38.61 63.25,39.12 65.79,41.66 71.63,41.66 73.66,43.69 73.66,44.2 71.12,46.74 69.85,46.74 69.34,46.23 69.34,45.97 66.55,43.18 v65.79,43.18 | 53.34,45.21 v53.85,45.21
D4  (via drill 0.3)
  Top 0.305: v40.89,55.12 40.89,56.9 IC8.44 | v45.72,52.58 45.72,50.55 50.55,45.72 52.32,45.72 54.1,43.94 56.39,43.94 56.64,43.69 56.64,43.43 60.71,39.37 61.47,39.37 66.04,34.8 69.34,34.8 72.39,31.75 IC6.9
  Bottom 0.305: v40.89,55.12 42.93,55.12 45.47,52.58 v45.72,52.58
D12  (via drill 0.3)
  Top 0.305: v41.4,43.43 41.4,45.47 IC8.13 | v39.12,41.15 39.12,36.58 34.8,32.26 v34.8,31.75 | v66.55,54.36 v66.55,51.82 | v58.17,61.72 56.64,61.72 55.88,62.48 LCD.16
  Bottom 0.305: v39.12,41.15 v41.4,43.43 | v34.8,31.75 52.32,31.75 66.55,45.97 v66.55,51.82 | v66.55,54.36 66.29,54.36 66.04,54.1 65.53,54.1 58.17,61.47 v58.17,61.72
D13  (via drill 0.3)
  Top 0.305: v42.16,44.2 42.16,45.47 IC8.14 | v34.54,38.35 v38.86,42.67 | v21.59,37.08 v25.4,33.27 | v16.26,65.79 22.86,65.79 23.88,64.77 23.88,63.75 22.86,62.74 LCD.3
  Bottom 0.305: v42.16,44.2 40.39,44.2 v38.86,42.67 | v34.54,38.35 30.48,38.35 v25.4,33.27 | v21.59,37.08 21.59,41.15 15.24,47.5 15.24,64.77 v16.26,65.79
D14  (via drill 0.3)
  Top 0.305: v43.18,47.24 43.18,45.72 IC8.15 | v57.15,54.86 59.18,56.9 61.72,56.9 63.75,58.93 63.75,64.26 P0.2
  Bottom 0.305: v43.18,47.24 46.23,44.2 46.23,43.43 52.32,37.34 54.36,37.34 57.15,40.13 57.15,41.4 57.66,41.91 57.66,45.97 57.15,46.48 v57.15,54.86
D15  (via drill 0.3)
  Top 0.305: v44.45,48.26 43.94,47.75 43.94,45.72 IC8.16 | v52.83,38.1 53.59,37.34 59.94,37.34 v60.2,37.59 | v70.1,45.97 70.1,60.2 63.5,66.8 P0.1
  Bottom 0.305: v44.45,48.26 44.96,48.26 45.47,47.75 45.72,47.75 46.74,46.74 46.74,43.69 52.32,38.1 v52.83,38.1 | v60.2,37.59 64.77,42.16 66.29,42.16 v70.1,45.97
D18  (via drill 0.3)
  Top 0.305: v48.01,47.24 48.01,45.72 IC8.21 | v46.74,69.6 45.72,69.6 45.47,69.85 v37.59,69.85 | v34.04,69.85 31.75,67.56 31.75,64.01 30.48,62.74 LCD.6
  Bottom 0.305: v48.01,47.24 48.01,47.75 50.55,50.29 50.55,55.12 54.86,59.44 54.86,64.01 55.12,64.26 55.12,66.04 54.61,66.55 54.61,67.56 52.58,69.6 v46.74,69.6 | v34.04,69.85 v37.59,69.85
D19  (via drill 0.3)
  Top 0.305: v50.04,44.2 48.77,45.47 IC8.22 | v53.59,38.61 54.36,37.85 59.44,37.85 59.94,38.35 60.45,38.35 v61.21,37.59 | v51.56,27.94 v53.09,29.46 | v37.08,25.65 36.32,24.89 36.32,22.61 35.81,22.1 33.53,22.1 32,20.57 32,20.32 31.5,19.81 v29.21,19.81 | v14.22,65.79 20.32,71.88 23.37,71.88 23.62,71.63 v25.65,71.63 | v26.67,66.55 26.67,64.01 25.4,62.74 LCD.4
  Bottom 0.305: v50.04,44.2 50.04,42.16 v53.59,38.61 | v53.09,29.46 v61.21,37.59 | v51.56,27.94 47.75,27.94 46.48,29.21 40.64,29.21 v37.08,25.65 | v29.21,19.81 23.11,19.81 19.81,23.11 11.18,23.11 4.06,30.23 4.06,34.8 2.79,36.07 1.52,36.07 0.76,36.83 0.76,43.69 1.52,44.45 2.79,44.45 14.22,55.88 v14.22,65.79 | v25.65,71.63 25.65,70.1 26.67,69.09 v26.67,66.55
D20  (via drill 0.3)
  Top 0.305: v56.13,47.5 55.37,46.74 54.86,46.74 54.36,47.24 50.55,47.24 IC8.23 | v41.91,66.29 41.91,63.75 42.93,62.74 LCD.11
  Bottom 0.305: v56.13,47.5 56.13,58.67 57.15,59.69 57.15,69.34 54.36,72.14 46.48,72.14 41.91,67.56 v41.91,66.29
D21  (via drill 0.3)
  Top 0.305: v46.48,53.34 46.48,51.31 49.53,48.26 50.29,48.26 IC8.24 50.55,48.01 v51.82,48.01 | v50.8,44.96 50.8,40.39 IC5.14
  Bottom 0.305: v46.48,53.34 45.72,54.1 45.72,62.48 LCD.12 | v50.8,44.96 51.82,45.97 v51.82,48.01
D22  (via drill 0.3)
  Top 0.305: 53.85,48.77 50.55,48.77 IC8.25 | v55.12,47.5 54.36,48.26 | 54.36,48.26 53.85,48.77 | v54.61,38.61 54.61,40.13 IC5.11 | v52.58,54.36 52.58,56.13 48.26,60.45 48.26,62.48 LCD.13 | 53.85,48.77 v53.85,49.02 | v70.87,56.13 v77.22,49.78 | v67.56,59.44 65.53,59.44 61.47,55.37 58.67,55.37 56.13,52.83 56.13,50.04 54.36,48.26
  Bottom 0.305: v55.12,47.5 55.12,39.12 v54.61,38.61 | v52.58,54.36 54.1,52.83 54.1,49.28 v53.85,49.02 | v77.22,49.78 90.17,36.83 90.17,30.73 88.65,29.21 88.65,27.43 89.66,26.42 89.66,16 82.55,8.89 82.55,4.57 EXTOUT.4 | v67.56,59.44 v70.87,56.13
D23  (via drill 0.3)
  Top 0.305: v47.5,53.85 47.5,51.31 49.02,49.78 50.29,49.78 IC8.26
  Bottom 0.305: v47.5,53.85 47.5,54.36 46.99,54.86 46.99,55.88 50.8,59.69 51.05,59.69 51.56,60.2 51.56,61.72 50.8,62.48 LCD.14
D+
  Top 0.305: R-.1 41.91,28.96 41.91,31.75 IC7.2
D-
  Top 0.305: R+.1 41.91,26.92 43.18,28.19 43.18,31.75 IC7.3
GND  (via drill 0.3)
  Top 0.305: 62.23,68.33 64.77,68.33 P2.1 | 62.23,68.33 60.45,68.33 59.69,67.56 59.69,66.55 60.96,65.28 60.96,62.99 C6.2 | IC3.4 62.99,53.85 66.29,57.15 BAT1.P$1 67.31,57.15 68.33,58.17 68.33,60.45 62.23,66.55 62.23,68.33 | 93.47,40.64 P4.3 | 93.47,40.64 95.5,38.61 98.3,38.61 B3.2 | 93.47,50.04 94.23,50.04 95.5,48.77 98.3,48.77 B2.2 | 93.47,50.04 P5.3 | C8.1 83.31,39.62 83.31,42.67 C7.1 83.57,42.67 83.57,49.78 92.71,58.93 93.47,58.93 | 93.47,58.93 98.3,58.93 B1.2 | 93.47,58.93 93.47,50.04 | 93.47,50.04 93.47,40.64 | 69.34,42.67 69.34,40.89 69.85,40.39 | 69.85,40.39 71.12,40.39 IC6.21 | 69.85,40.39 IC6.22 | 76.45,27.69 76.45,28.7 74.93,30.23 IC6.11 IC6.18 74.93,40.89 73.66,42.16 73.66,42.67 CX2.2 73.41,42.67 73.41,43.18 v72.64,43.94 | v70.61,42.67 69.34,42.67 | 69.34,42.67 CX1.2 | 76.45,27.69 77.22,26.92 | 77.22,26.92 77.72,26.42 79.5,26.42 81.03,24.89 84.84,24.89 RJ1.GND | 76.45,27.69 RBS.1 | 89.15,10.67 89.15,4.57 87.63,3.05 87.63,2.03 EXTOUT.7 EXTOUT.5 84.07,2.03 82.8,3.3 79.5,3.3 77.72,5.08 77.72,5.84 72.39,11.18 RAIN.1 70.36,14.22 | RJ1.SHIELD1 89.15,10.67 | RJ1.G- 98.81,16.26 98.81,24.38 RJ1.Y- | 77.22,26.92 75.69,25.4 75.69,21.34 86.36,10.67 89.15,10.67 | C5.2 54.86,51.05 54.86,51.82 53.59,53.09 53.09,53.09 51.31,51.31 IC8.28 v48.51,51.31 | C4.2 45.21,42.42 45.21,44.45 45.47,44.7 45.47,45.47 IC8.18 45.47,45.72 v45.47,46.99 | 40.39,51.31 IC8.6 | 40.39,51.31 44.7,55.63 IC8.39 44.7,57.91 43.43,59.18 43.43,59.69 C9.2 41.4,59.69 40.89,60.2 v37.85,60.2 | 40.39,51.31 v40.64,51.05 | P0.14 30.48,65.28 27.94,62.74 LCD.5 27.69,62.48 27.69,60.96 | 27.69,60.96 ISP.6 | 14.22,58.93 14.99,58.93 U1.6
  Top 0.305: 14.22,58.93 13.72,59.44 13.72,62.74 14.22,63.25 U1.GND1 14.48,63.25 17.02,63.25 17.53,62.74 LCD.1 17.78,62.48 19.3,60.96 27.69,60.96 | 18.54,46.48 20.07,44.96 IC1.5 20.07,44.7 D3.A | 18.54,46.48 16.26,48.77 14.73,48.77 U1.GND3 14.48,49.02 13.72,49.78 13.72,58.42 14.22,58.93 | 19.56,41.66 19.05,42.16 18.8,42.16 18.54,42.42 18.54,46.48 | 19.56,41.66 19.81,41.4 IC1.3 19.56,41.66 | U1.P$2 5.08,63.25 5.59,62.74 5.59,52.07 5.08,51.56 5.08,48.01 U1.P$1 5.08,47.75 5.08,38.1 5.84,37.34 5.84,31.24 10.67,26.42 USB.GND 10.67,15.75 | 10.67,15.75 4.83,15.75 J0.1 | 10.67,15.75 C3.- | T8.1 66.04,14.48 67.56,14.48 V8.1 70.36,14.22 | 64.01,28.45 64.01,30.23 63.5,30.73 IC6.2 | 69.34,23.88 69.6,23.88 V7.1 71.37,22.1 71.37,18.03 70.36,17.02 70.36,14.22 | 69.34,23.88 68.33,23.88 T7.1 | 69.34,23.88 64.77,28.45 CAP.2 64.01,28.45 | T3.1 48.01,23.88 49.28,23.88 V3.1 49.78,22.61 51.56,20.83 51.56,16 | 57.91,27.43 57.91,24.13 T5.1 58.17,23.88 58.67,23.37 V5.1 | 57.91,27.43 57.91,28.19 57.15,28.96 57.15,33.78 IC5.8 | V1.1 39.12,23.88 37.85,23.88 T1.1 37.59,23.88 37.59,23.11 35.31,20.83 35.31,20.32 34.29,19.3 33.27,19.3 33.02,19.05 33.02,16 | v44.45,28.19 44.45,31.75 IC7.4 | 20.07,16.76 20.07,19.81 19.3,20.57 C1'.- C1.- 18.03,23.11 18.03,40.13 19.56,41.66 | 20.07,16.76 20.07,16 IC2.1 20.07,16.76 | V6.1 57.15,14.48 55.88,14.48 T6.1 55.63,14.73 54.36,16 51.56,16 | 27.18,11.68 28.7,13.21 28.7,16 | 27.18,11.68 26.92,11.43 26.92,10.16 D2.A | 28.7,16 28.7,19.3 27.69,20.32 C2.- | 28.7,16 33.02,16 | 33.02,16 34.04,16 35.31,14.73 T2.1 35.56,14.48 36.83,14.48 V2.1 39.37,16 44.2,16 45.47,14.73 T4.1 45.72,14.48 46.99,14.48 V4.1 49.53,16 51.56,16
  Top 0.305: 20.07,16.76 24.38,16.76 25.65,15.49 25.65,13.21 27.18,11.68 | 64.01,28.45 64.01,27.94 63.25,27.18 59.94,27.18 59.69,27.43 57.91,27.43
  Bottom 0.305: P2.1 66.8,67.06 80.26,53.59 87.88,53.59 P5.3 | v70.61,42.67 71.37,42.67 v72.64,43.94 | 91.44,28.45 94.49,28.45 98.55,24.38 RJ1.Y- | 91.44,28.45 90.93,28.45 RJ1.SHIELD0 91.44,28.45 | RJ1.SHIELD1 90.93,12.19 94.49,12.19 98.55,16.26 RJ1.G- | 91.44,28.45 P4.3 | v45.47,46.99 44.7,46.99 42.16,49.53 | v40.64,51.05 42.16,49.53 | v48.51,51.31 46.74,49.53 42.16,49.53 | v37.85,60.2 36.58,58.93 31.24,58.93 27.69,62.48 LCD.5 | V5.1 V3.1 | V1.1 v44.45,28.19 | J0.1 11.94,17.78 16,21.84 C1.-
  pour Top (isolate 0.305, hatched): 0,73.66 101.6,73.66 101.6,0 0,0
  pour Bottom (isolate 0.305, hatched): 0,73.66 101.6,73.66 101.6,0 0,0
INT0  (via drill 0.3)
  Top 0.305: v40.64,48.26 39.88,47.5 39.12,47.5 IC8.11 | v48.51,37.59 48.51,36.83 49.78,35.56 v57.4,35.56 | v67.31,48.51 69.09,50.29 v69.09,54.36 | v59.44,64.52 58.42,64.52 P0.4
  Bottom 0.305: v40.64,48.26 40.64,48.01 44.2,44.45 44.2,41.91 v48.51,37.59 | v57.4,35.56 59.44,37.59 59.44,37.85 67.31,45.72 v67.31,48.51 | v69.09,54.36 66.29,57.15 66.29,57.66 v59.44,64.52
INT1  (via drill 0.3)
  Top 0.305: v44.2,50.29 40.89,46.99 40.89,45.72 IC8.12 | v54.36,64.52 54.36,66.29 54.61,66.55 54.61,67.56 56.39,69.34 65.53,69.34 67.31,67.56 67.31,63.75 72.9,58.17 72.9,55.12 v76.71,51.31 | v75.95,18.03 75.95,13.46 77.22,12.19 RAIN.2
  Bottom 0.305: v44.2,50.29 46.48,50.29 48.26,52.07 48.51,52.07 49.02,52.58 49.02,53.59 47.5,55.12 47.5,55.63 51.05,59.18 52.07,59.18 54.36,61.47 v54.36,64.52 | v76.71,51.31 76.71,50.29 74.68,48.26 74.68,40.64 72.9,38.86 72.9,32 76.96,27.94 76.96,25.4 78.49,23.88 78.49,20.57 v75.95,18.03
INT2  (via drill 0.3)
  Top 0.305: v36.32,59.69 36.58,59.44 40.89,59.44 42.16,58.17 42.16,57.15 IC8.42 | v28.7,64.52 28.7,67.56 25.15,71.12 v20.57,71.12 | v21.34,35.81 21.34,31.5 v21.84,30.99 | v65.79,55.37 v65.79,51.31
  Bottom 0.305: v36.32,59.69 31.24,59.69 28.96,61.98 28.96,64.26 v28.7,64.52 | v20.57,71.12 14.73,65.28 14.73,42.42 v21.34,35.81 | v21.84,30.99 33.02,30.99 34.54,32.51 52.32,32.51 65.79,45.97 v65.79,51.31 | v65.79,55.37 65.79,57.15 58.42,64.52 P0.3
LEDA
  Top 0.305: REA.2 79.5,21.34 79.5,18.8 83.57,14.73 90.68,14.73 92.96,17.02 95.25,17.02 98.55,13.72 RJ1.G+
LEDB
  Top 0.305: REB.2 79.76,24.13 79.76,23.37 83.57,19.56 83.57,19.3 84.33,18.54 85.85,18.54 87.12,19.81 91.44,19.81 98.55,26.92 RJ1.Y+
MISO  (via drill 0.3)
  Top 0.305: v36.83,54.1 37.08,54.36 38.86,54.36 IC8.2 | ISP.1 29.97,49.78 28.7,51.05 23.88,51.05 20.32,54.61 20.32,55.37 15.75,59.94 15.24,59.94 U1.7 | v68.58,28.45 IC6.6 | v58.67,25.91 v66.04,25.91 | v45.97,28.45 45.97,30.48 45.47,30.99 45.47,33.27 44.2,34.54 41.91,34.54 41.4,35.05 41.4,35.56 42.67,36.83 42.93,36.83 43.43,37.34 43.43,39.37 IC7.6 43.18,39.62 43.18,40.64 42.67,41.15 42.42,41.15 v39.37,44.2
  Bottom 0.305: v36.83,54.1 37.08,54.1 37.34,54.36 37.85,54.36 38.35,53.85 38.35,50.8 37.59,50.04 | 37.59,50.04 37.34,49.78 ISP.1 | v66.04,25.91 v68.58,28.45 | v58.67,25.91 55.12,25.91 54.86,25.65 48.77,25.65 v45.97,28.45 | 37.59,50.04 39.37,48.26 v39.37,44.2
MOSI  (via drill 0.3)
  Top 0.305: IC8.1 38.86,55.37 31.5,55.37 30.73,56.13 29.72,56.13 28.96,55.37 28.96,53.59 ISP.4 v24.89,52.32 | U1.3 15.24,55.37 17.78,55.37 v20.83,52.32 26.16,46.99 v28.7,46.99 | v69.85,29.21 IC6.7 | v46.48,30.99 46.48,33.27 44.45,35.31 | 44.45,35.31 43.94,35.81 43.94,37.85 44.45,38.35 44.45,39.37 IC7.5 | 44.45,35.31 v42.16,35.31
  Bottom 0.305: v24.89,52.32 v20.83,52.32 | v69.85,29.21 53.85,29.21 53.34,28.7 48.77,28.7 v46.48,30.99 | v28.7,46.99 30.48,46.99 v42.16,35.31
N$1
  Top 0.61: C1.+ C1'.+ 19.3,31.75 D1.C 19.56,32 19.81,32.26 19.81,37.85 IC1.1
N$2  (via drill 0.3)
  Top 0.61: F1.1 27.18,14.99 27.18,18.03 26.42,18.8 26.42,23.88 27.69,25.15 C2.+ 27.94,25.4 27.94,37.85 v28.7,38.61 | 30.73,43.18 20.07,43.18 IC1.4 | 30.73,43.18 31.75,42.16 L1.2 | L1'.2 31.75,44.45 30.73,43.43 30.73,43.18
  Bottom 0.61: v28.7,38.61 31.75,41.66 L1.2
N$3  (via drill 0.3)
  Top 0.305: v45.21,26.67 47.24,28.7 RN2.1 | v34.29,25.4 33.02,24.13 T1.3
  Bottom 0.305: 39.62,21.08 v45.21,26.67 | v34.29,25.4 38.61,21.08 39.62,21.08 | 39.62,21.08 JP2.1
N$4
  Top 0.305: RN3.7 54.61,30.23 54.61,32 53.34,33.27 53.34,33.78 IC5.5
N$5
  Top 0.305: RN3.6 55.37,30.23 55.37,32.51 54.61,33.27 54.61,33.78 IC5.6
N$6
  Top 0.61: J2.2 2.03,39.12 4.32,36.83 4.32,22.1 1.27,19.05 1.27,14.48 2.79,12.95 J0.2
N$7
  Top 0.305: RN3.5 56.39,30.23 56.39,32.77 55.88,33.27 55.88,33.78 IC5.7
N$8
  Top 0.305: IC3.1 58.93,53.59 X1.2 58.67,51.31 X1'1.1
N$9
  Top 0.61: IC1.2 20.07,39.88 22.86,39.88 D3.C 23.88,40.64 27.94,40.64 31.5,37.08 L1.1 L1'.1
N$10
  Top 0.305: RN3.8 53.59,30.23 53.59,31.75 52.07,33.27 52.07,33.78 IC5.4
N$11
  Top 0.305: RN2.5 50.29,30.23 50.29,33.53 50.55,33.78 IC5.3
N$12
  Top 0.305: RN2.6 49.28,30.23 49.28,33.78 IC5.2
N$13
  Top 0.305: RN2.7 48.26,30.23 48.26,33.78 IC5.1
N$14
  Top 0.305: RN2.8 47.24,30.23 47.24,37.34 49.28,39.37 49.28,40.13 IC5.15
N$15  (via drill 0.3)
  Top 0.305: v38.35,16 38.86,16.51 39.37,16.51 41.4,18.54 41.4,24.64 42.16,25.4 42.42,25.4 42.93,25.91 46.74,25.91 48.26,27.43 48.26,28.7 RN2.2 | JP3.1 36.07,12.7 32.51,12.7 30.73,14.48 T2.3
  Bottom 0.305: v38.35,16 38.35,12.45 JP3.1
N$16  (via drill 0.3)
  Top 0.61: DF1.A 37.72,20.19 | 37.72,20.19 V1.2 | 37.72,20.19 35.31,17.78 T1.4 36.32,18.54 v36.32,16
  Bottom 0.61: S12.1 31.75,6.86 33.27,8.38 33.27,12.95 v36.32,16
N$17
  Top 0.61: DF2.A 35.43,10.79 | 35.43,10.79 V2.2 36.83,9.14 36.83,2.79 S12.2 | 35.43,10.79 33.02,8.38 T2.4
N$18  (via drill 0.3)
  Top 0.61: DF3.A 47.88,20.19 | 47.88,20.19 V3.2 | 47.88,20.19 45.47,17.78 T3.4 46.48,18.54 v46.48,16
  Bottom 0.61: S34.1 41.91,9.4 43.43,10.92 43.43,12.95 v46.48,16
N$19
  Top 0.305: 46.74,25.4 44.45,25.4 43.18,24.13 T3.3 | 46.74,25.4 46.99,25.4 49.02,27.43 49.02,28.7 RN2.3 | JP4.1 49.02,20.83 47.5,22.35 46.99,22.35 46.74,22.61 46.74,25.4
N$20
  Top 0.61: DF4.A 45.59,10.79 | 45.59,10.79 V4.2 46.99,9.14 46.99,2.79 S34.2 | 45.59,10.79 43.18,8.38 T4.4
N$21  (via drill 0.3)
  Top 0.305: v52.07,22.61 50.29,24.38 50.29,28.7 RN2.4 | v50.8,19.05 50.8,17.78 49.53,16.51 49.02,16.51 v48.51,16 | JP5.1 46.23,12.7 42.67,12.7 40.89,14.48 T4.3
  Bottom 0.305: v52.07,22.61 52.07,20.32 v50.8,19.05 | v48.51,16 48.51,12.45 JP5.1
N$22  (via drill 0.3)
  Top 0.61: DF5.A 58.04,20.19 | 58.04,20.19 V5.2 v59.94,9.4 | 58.04,20.19 55.63,17.78 T5.4
  Bottom 0.61: S56.1 53.34,2.79 v59.94,9.4
N$23
  Top 0.61: DF6.A 55.75,10.79 | 55.75,10.79 V6.2 57.15,9.14 57.15,2.79 S56.2 | 55.75,10.79 53.34,8.38 T6.4
N$24
  Top 0.61: DF7.A 68.2,20.19 | 68.2,20.19 V7.2 | 68.2,20.19 65.79,17.78 T7.4
  Bottom 0.61: S78.1 63.25,2.79 70.1,9.65 V7.2
N$25
  Top 0.61: 66.04,10.92 65.53,11.43 DF8.A | 66.04,10.92 V8.2 67.31,9.4 67.31,2.79 S78.2 | 66.04,10.92 63.5,8.38 T8.4
N$26  (via drill 0.3)
  Top 0.305: RN3.1 53.59,28.7 53.59,24.38 53.34,24.13 T5.3 53.34,23.88 v55.12,22.1
  Bottom 0.305: v55.12,22.1 58.67,22.1 JP6.1
N$27  (via drill 0.3)
  Top 0.305: v54.61,27.43 54.61,28.7 RN3.2 | JP7.1 56.39,12.7 52.83,12.7 51.05,14.48 T6.3
  Bottom 0.305: v54.61,27.43 59.69,27.43 65.79,21.34 65.79,13.72 63.5,11.43 63.5,10.92 62.74,10.16 58.93,10.16 JP7.1
N$28  (via drill 0.3)
  Top 0.305: v54.61,26.42 55.37,27.18 55.37,28.7 RN3.3 | JP8.1 68.83,22.1 65.28,22.1 63.5,23.88 T7.3
  Bottom 0.305: v54.61,26.42 53.85,27.18 53.85,27.69 54.36,28.19 60.45,28.19 66.55,22.1 68.07,22.1 69.34,20.83 JP8.1
N$29
  Top 0.305: RN3.4 56.64,28.7 56.64,22.86 57.4,22.1 60.45,22.1 61.21,21.34 61.21,14.73 T8.3 61.21,14.48 62.74,12.95 65.53,12.95 66.8,11.68 JP9.1
N$30
  Top 0.305: IC3.2 60.45,53.59 60.45,52.58 X1.1 61.72,51.31 X1'1.4
N$34  (via drill 0.3)
  Top 0.305: v77.72,22.61 77.72,21.34 REA.1 | v64.26,38.86 63.5,39.62 IC6.27
  Bottom 0.305: v77.72,22.61 64.26,36.07 v64.26,38.86
N$36  (via drill 0.3)
  Top 0.305: v68.33,50.55 64.26,50.55 61.72,53.09 61.72,53.59 IC3.3 | v79.5,51.82 79.5,53.34 83.31,57.15 BAT1.P$2
  Bottom 0.305: v68.33,50.55 74.93,50.55 76.45,52.07 79.25,52.07 v79.5,51.82
N$37  (via drill 0.3)
  Top 0.305: REB.1 77.22,24.13 v76.45,24.89 | v65.28,38.86 65.28,39.62 64.77,40.13 IC6.26
  Bottom 0.305: v76.45,24.89 76.45,27.69 v65.28,38.86
N$38  (via drill 0.3)
  Top 0.305: v37.34,28.96 R-.2 | v28.96,24.64 v30.48,26.16 | v16.51,24.13 13.21,27.43 11.68,27.43 10.67,28.45 USB.D+
  Bottom 0.305: v37.34,28.96 34.54,26.16 v30.48,26.16 | v28.96,24.64 20.32,24.64 19.81,24.13 v16.51,24.13
N$39
  Top 0.305: IC6.1 62.23,28.45 CAP.1
N$41
  Top 0.305: IC6.24 67.31,42.67 | 67.31,45.47 67.31,45.97 66.8,46.48 X2.P$2 | 67.31,45.47 67.31,42.67 | 67.31,42.67 CX1.1 | 67.31,45.47 X2'.2
N$42  (via drill 0.3)
  Top 0.305: CX2.1 71.88,42.67 71.88,44.96 X2'.1 X2.P$1 | v68.58,38.86 IC6.23
  Bottom 0.305: v68.58,38.86 69.6,38.86 74.17,43.43 74.17,45.72 X2'.1
N$45  (via drill 0.3)
  Top 0.305: R+.2 RUSB.1 37.34,26.92 37.34,27.94 v36.32,28.96
  Bottom 0.305: v36.32,28.96 26.92,28.96 25.4,30.48 22.35,30.48 16.76,24.89 10.16,24.89 9.4,25.65 9.4,26.67 10.16,27.43 11.43,27.43 12.45,28.45 USB.D-
N$52  (via drill 0.3)
  Top 0.305: SJ1.1 31.75,53.34 ISP.5 | v40.64,33.78 40.64,32 IC7.1 | v26.92,33.78 26.16,33.78 v23.11,36.83 | v22.35,54.86 25.91,54.86 v26.42,55.37
  Bottom 0.305: v26.92,33.78 v40.64,33.78 | v23.11,36.83 23.11,49.02 20.07,52.07 20.07,52.58 v22.35,54.86 | v26.42,55.37 27.18,56.13 28.96,56.13 ISP.5
N$54
  Top 0.305: RN4.6 82.8,36.83 RN4.5 83.82,36.83 83.82,38.35 85.09,39.62 85.09,42.67 C7.2
N$59
  Top 0.305: RBS.2 78.49,27.69 78.49,30.48 78.74,30.73 IC6.14
QH*  (via drill 0.3)
  Top 0.305: v67.31,34.04 66.04,34.04 61.21,38.86 60.45,38.86 59.18,40.13 57.15,40.13 IC5.9 | v72.9,28.45 72.9,14.99 75.95,11.94 75.95,8.38 79.76,4.57 EXTOUT.2
  Bottom 0.305: v72.9,28.45 v67.31,34.04
RD+  (via drill 0.3)
  Top 0.305: 81.28,32 83.57,34.29 83.57,35.31 RN4.4 | 81.28,32 78.23,32 77.47,31.24 IC6.13 | 81.28,32 v82.3,30.99
  Bottom 0.305: RJ1.RD+ 87.38,19.3 86.11,20.57 86.11,27.18 v82.3,30.99
RD-  (via drill 0.3)
  Top 0.305: 81.28,33.53 80.77,33.02 77.98,33.02 76.2,31.24 IC6.12 | 81.28,33.53 82.55,34.8 82.55,35.31 RN4.3 | 81.28,33.53 v81.53,33.27
  Bottom 0.305: RJ1.RD- 84.84,23.11 81.53,26.42 v81.53,33.27
RESET  (via drill 0.3)
  Top 0.305: 37.34,52.58 37.59,52.83 38.86,52.83 IC8.4 39.12,52.83 39.88,52.83 40.13,52.58 v40.64,52.58 | 37.34,52.58 35.81,51.05 35.31,51.05 RN1.1 | SJ1.2 36.58,53.34 37.34,52.58 | IC6.10 73.66,30.23 71.12,27.69 v66.55,27.69 | v59.44,26.67 v65.53,26.67 | v39.88,34.54 v39.88,30.48 | v46.23,37.85 v46.23,34.54 | v41.91,50.8 v40.39,49.28
  Bottom 0.305: v65.53,26.67 v66.55,27.69 | v59.44,26.67 59.44,25.65 58.93,25.15 47.75,25.15 45.47,27.43 44.96,27.43 40.64,23.11 40.64,22.86 40.13,22.35 39.12,22.35 36.32,25.15 36.32,26.92 v39.88,30.48 | v46.23,34.54 v39.88,34.54 | v46.23,37.85 46.23,39.12 42.93,42.42 42.93,44.96 39.88,48.01 39.88,48.77 v40.39,49.28 | v41.91,50.8 41.91,51.31 v40.64,52.58
RXD  (via drill 0.3)
  Top 0.305: v37.59,49.02 38.86,49.02 IC8.9 | v36.07,43.43 33.53,40.89 28.7,40.89 27.43,42.16 v22.35,42.16 | v41.91,71.88 46.74,71.88 50.8,67.82 P0.6
  Bottom 0.305: v37.59,49.02 36.07,47.5 v36.07,43.43 | v22.35,42.16 22.35,44.7 16.26,50.8 16.26,63.75 25.15,72.64 41.15,72.64 v41.91,71.88
SCK  (via drill 0.3)
  Top 0.305: v37.59,53.59 38.86,53.59 IC8.3 | v17.02,57.66 15.24,57.66 U1.5 | v22.86,57.66 v19.56,57.66 | IC6.8 71.12,32.26 70.1,33.27 64.01,33.27 60.45,36.83 v50.29,36.83 | v42.67,37.59 42.16,38.1 42.16,39.37 IC7.7 | v37.08,50.55 37.08,49.53 36.83,49.28 36.83,46.23 v38.1,44.96
  Bottom 0.305: v37.59,53.59 37.59,53.09 36.07,51.56 | 36.07,51.56 35.81,51.31 31.24,51.31 ISP.3 28.96,53.59 26.92,53.59 v22.86,57.66 | v19.56,57.66 v17.02,57.66 | v50.29,36.83 43.43,36.83 v42.67,37.59 41.66,37.59 38.1,41.15 v38.1,44.96 | v37.08,50.55 36.07,51.56
SCL  (via drill 0.3)
  Top 0.305: v32.26,52.07 32.77,52.07 33.27,51.56 33.27,51.05 RN1.3 | v39.62,60.96 39.62,66.04 P0.10 | v44.96,54.86 44.96,50.55 46.23,49.28 46.23,45.72 IC8.19 | v62.99,64.01 62.23,63.25 62.23,61.98 61.72,61.47 61.72,60.2 IC3.6 | v70.87,54.36 70.87,52.32 v75.44,47.75 | v16.26,21.08 16.26,22.86 17.27,23.88 17.27,24.64 17.02,24.89 17.02,35.56 17.27,35.81 17.27,46.99 16.76,47.5 13.72,47.5 12.7,48.51 12.7,63.75 13.46,64.52 v23.11,64.52
  Bottom 0.305: v32.26,52.07 32.26,53.59 32.77,54.1 | 32.77,54.1 v39.62,60.96 44.96,55.63 v44.96,54.86 | v62.99,64.01 66.8,60.2 66.8,58.42 v70.87,54.36 | v75.44,47.75 75.44,40.64 73.41,38.61 73.41,32.26 78.99,26.67 78.99,16.26 67.06,4.32 66.29,4.32 62.48,0.51 18.03,0.51 16.26,2.29 v16.26,21.08 | v23.11,64.52 24.38,63.25 24.38,59.69 27.43,56.64 30.23,56.64 32.77,54.1
SDA  (via drill 0.3)
  Top 0.305: v29.72,51.05 32.26,51.05 RN1.4 | v44.7,36.07 44.7,37.34 46.99,39.62 46.99,45.47 IC8.20 | v62.99,62.99 62.99,60.2 IC3.5 62.74,59.94 62.74,59.18 61.98,58.42 58.42,58.42 v57.4,57.4
  Bottom 0.305: v29.72,51.05 28.96,50.29 28.96,49.28 42.16,36.07 v44.7,36.07 55.12,36.07 60.45,41.4 60.45,54.36 v57.4,57.4 | v62.99,62.99 59.69,66.29 59.69,67.56 54.61,72.64 43.69,72.64 P0.11
TCT  (via drill 0.3)
  Top 0.305: 81.53,36.83 81.79,36.83 RN4.7 | 81.53,36.83 RN4.8 | 81.53,39.62 81.53,37.85 | 81.53,37.85 81.53,36.83 | 81.53,39.62 81.53,42.67 L2.1 | 81.53,39.62 C8.2 | RJ1.P4 84.84,20.57 86.11,21.84 86.11,28.96 84.33,30.73 v84.33,36.07 | 81.53,37.85 v82.55,37.85
  Bottom 0.305: v82.55,37.85 v84.33,36.07
TD+  (via drill 0.3)
  Top 0.305: v79.76,36.58 80.77,35.56 RN4.1 | v77.22,41.91 76.2,40.89 IC6.17 v76.2,36.83 | v80.26,20.07 84.33,16 87.38,16 RJ1.TD+
  Bottom 0.305: v79.76,36.58 79.76,39.37 v77.22,41.91 | v80.26,20.07 80.26,32.77 v76.2,36.83
TD-  (via drill 0.3)
  Top 0.305: 81.03,34.54 80.52,34.54 77.47,37.59 IC6.16 | 81.03,34.54 81.53,34.54 81.79,34.8 81.79,35.31 RN4.2 | 81.03,34.54 v81.03,34.29
  Bottom 0.305: v81.03,34.29 81.53,34.29 82.3,33.53 82.3,32.77 88.65,26.42 88.65,18.03 87.88,17.27 84.84,17.27 RJ1.TD-
TXD  (via drill 0.3)
  Top 0.305: v37.59,48.01 38.86,48.01 IC8.10 | v33.27,39.62 v37.08,43.43 | v26.92,35.81 25.15,35.81 v22.35,38.61 | v23.88,72.39 37.08,72.39 v37.59,71.88 | v40.89,71.88 42.42,70.36 47.24,70.36 v49.28,68.33
  Bottom 0.305: v37.59,48.01 37.59,45.72 37.08,45.21 v37.08,43.43 | v33.27,39.62 30.73,39.62 v26.92,35.81 | v22.35,38.61 22.35,41.15 15.75,47.75 15.75,64.26 v23.88,72.39 | v40.89,71.88 v37.59,71.88 | v49.28,68.33 52.07,68.33 P0.5
VCC  (via drill 0.3)
  Top 0.305: 55.63,41.66 55.63,40.39 IC5.10 | 55.63,41.66 55.63,42.67 RPR.2 | IC6.28 62.23,40.89 62.99,41.66 | 62.99,41.66 65.28,41.66 66.04,40.89 IC6.25 66.04,39.88 67.82,38.1 70.61,38.1 71.88,39.37 71.88,39.62 72.39,40.13 IC6.20 72.39,40.39 73.66,40.39 IC6.19 73.66,38.86 v74.17,38.35 | 55.63,41.66 57.4,41.66 v57.91,41.15 | 62.99,41.66 v59.69,41.66 | 79.5,42.67 79.5,41.15 78.99,40.64 | 78.99,40.64 78.74,40.39 IC6.15 78.99,40.64 | 79.5,42.67 79.5,50.04 73.41,56.13 73.41,62.23 P1.1 | 79.5,42.67 L2.2 | 78.99,40.64 v78.99,38.86 | v51.82,50.55 50.55,50.55 IC8.27 | v49.28,42.16 48.26,41.15 48.26,40.39 IC5.16 | v48.26,55.37 46.48,55.37 45.47,56.39 45.47,56.9 IC8.38 45.47,57.15 45.47,59.44 45.21,59.69 C9.1 44.96,59.69 44.45,60.2 v44.45,63.5 | v45.47,48.77 45.47,48.26 44.7,47.5 IC8.17 44.7,44.7 43.43,43.43 43.43,42.42 C4.1 42.16,42.42 v41.91,42.67 | v35.56,64.52 P0.12 | 34.54,49.53 RN1.8 35.31,49.78 37.59,52.07 38.86,52.07 IC8.5 | 34.54,49.53 34.29,49.53 RN1.7 | 34.54,49.53 33.53,48.51 | 33.53,48.51 32.77,47.75 26.42,47.75 17.53,56.64 15.24,56.64 U1.4 | 17.78,9.65 16.76,10.67 10.67,10.67 C3.+ | 35.56,28.96 35.56,32.26 40.64,37.34 40.64,39.37 IC7.8 40.64,39.62 40.64,41.66 | 35.56,28.96 35.56,26.92 RUSB.2 | v20.32,9.65 17.78,9.65 | v31.24,20.57 31.24,24.64 35.56,28.96 | 17.78,9.65 IC2.4 | 33.53,48.51 38.61,43.43 39.12,43.43 40.64,41.91 40.64,41.66 | 40.64,41.66 v40.89,41.66 | v57.91,46.74 56.13,46.74 55.63,46.23 51.05,46.23 v50.8,46.48
  Bottom 0.305: 58.17,41.15 59.18,41.15 v59.69,41.66 | v78.99,38.86 78.99,38.35 | 78.99,38.35 78.99,34.8 81.03,32.77 81.03,4.06 80.01,3.05 80.01,2.03 EXTOUT.1 | 78.99,38.35 v74.17,38.35 | v51.82,50.55 51.82,49.02 50.04,47.24 | 50.04,47.24 49.28,46.48 49.28,44.96 | v49.28,42.16 49.28,44.96 | v48.26,55.37 49.53,54.1 49.53,50.04 47.24,47.75 47.24,46.99 | 49.28,44.96 47.24,46.99 | 47.24,46.99 v45.47,48.77 | v35.56,64.52 43.43,64.52 v44.45,63.5 | v31.24,20.57 v20.32,9.65 | v40.89,41.66 v41.91,42.67 | 58.17,41.15 58.17,46.48 v57.91,46.74 | 50.04,47.24 v50.8,46.48 | 58.17,41.15 v57.91,41.15
VIN  (via drill 0.3)
  Top 0.61: C6.1 59.18,62.99 59.18,60.2 IC3.8 58.93,60.71 55.12,60.71 53.34,62.48 LCD.15 | RN1.6 33.27,49.53 RN1.5 32.26,49.53 31.24,48.51 28.96,48.51 ISP.2 | P5.1 91.19,55.12 88.65,52.58 88.65,45.72 89.92,44.45 90.17,44.45 P4.2 91.19,43.18 89.41,41.4 89.41,33.78 90.17,33.02 90.17,30.23 88.9,28.96 88.9,22.61 v90.93,20.57 | USB.VBUS 12.7,26.16 12.7,18.54 15.24,16 IC2.3 15.49,15.75 16.51,14.73 16.51,14.48 17.02,13.97 23.11,13.97 F1.2 23.11,14.99 23.37,14.73 23.37,10.16 D2.C 23.62,9.91 24.89,8.64 28.7,8.64 36.58,0.76 88.14,0.76 v88.9,1.52
  Bottom 0.61: 31.5,65.53 22.86,65.53 22.1,64.77 22.1,64.52 20.32,62.74 LCD.2 20.32,62.48 20.32,58.93 25.91,53.34 25.91,52.07 27.69,50.29 ISP.2 27.69,38.1 16,26.42 12.7,26.42 USB.VBUS | P0.13 31.5,65.53 | 31.5,65.53 35.81,65.53 36.07,65.28 51.31,65.28 53.09,63.5 53.09,62.74 LCD.15 | v90.93,20.57 90.93,14.99 88.9,12.95 v88.9,1.52

### Text on the board
tNames: OpenSprinkler (v2.0) | http://rayshobby.net (Apr 2013) | GND VIN VCC SDA SCL A05 A06 A07 RXD TXD IN0 IN2 D14 D15 GND VCC | GND A3 VIN | GND VIN A3 | RJ45 | RainSense | AC IN | DOUT CLK LAT !OE | 1 | 2 | 3 | 4 | 5 | 6 | 7 | 8 | EXTOUT
BoxDim: Serpac WM-032C Enclosure | All units are in inch | Left | Right | Front | Bottom